# Altium schematic sheet Controller.SchDoc
size A4
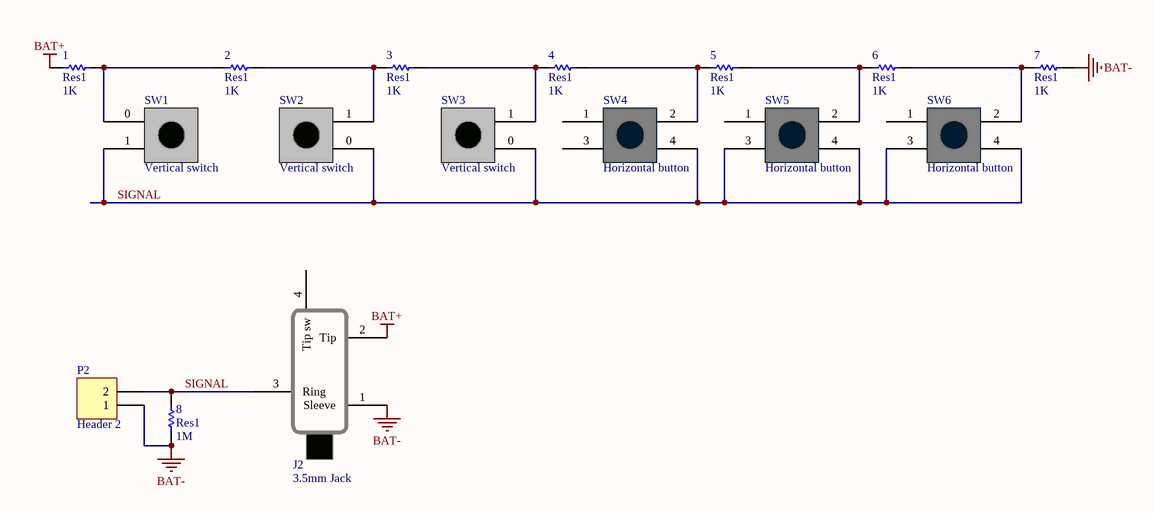
[diagram p0: Controller.SchDoc]

## Parts
1  Res1  value 1K  [6-0805_N]
2  Res1  value 1K  [6-0805_N]
3  Res1  value 1K  [6-0805_N]
4  Res1  value 1K  [6-0805_N]
5  Res1  value 1K  [6-0805_N]
6  Res1  value 1K  [6-0805_N]
7  Res1  value 1K  [6-0805_N]
8  Res1  value 1M  [6-0805_M]
J2  3.5mm Jack  [Phonejack]
P2  Header 2  [HDR1X2]
SW1  Vertical switch  [Btn_Vert]
SW2  Vertical switch  [Btn_Vert]
SW3  Vertical switch  [Btn_Vert]
SW4  Horizontal button  [Btn_Horiz]
SW5  Horizontal button  [Btn_Horiz]
SW6  Horizontal button  [Btn_Horiz]

## Nets
BAT+: 1.2 J2.2(Tip)
BAT-: 7.1 8.2 J2.1(Sleeve) P2.1
SIGNAL: 8.1 J2.3(Ring) P2.2 SW1.1 SW2.0 SW3.0 SW4.4 SW5.3 SW5.4 SW6.3 SW6.4
Net1_1: 1.1 2.2 SW1.0
Net2_1: 2.1 3.2 SW2.1
Net3_1: 3.1 4.2 SW3.1
Net4_1: 4.1 5.2 SW4.2
Net5_1: 5.1 6.1 SW5.2
Net6_2: 6.2 7.2 SW6.2

Not connected (* = marked no-connect by the designer): J2 4(Tip_sw); SW4 1 3; SW5 1; SW6 1

## Library data of the parts
1-8 = Res1: Resistor; Published: 8-Jun-2000; LatestRevisionDate: 17-Jul-2002; LatestRevisionNote: Re-released for DXP Platform.; PackageReference: AXIAL-0.3; Publisher: Altium Limited; PackageDescription: Axial Device, Thru-Hole; 2 Leads; 0.3 in Pin Spacing
J2 = Phonejack
P2 = Header 2: Header, 2-Pin; LatestRevisionDate: 17-Jul-2002; LatestRevisionNote: Re-released for DXP Platform.; Publisher: Altium Limited
SW1-SW3 = SWVERT
SW4-SW6 = HORIZBTN